# Altium schematic sheet FpgaCore.SchDoc: IrDA
size A4; Organization: Microprocessor-Design Pty Ltd; Address1: 18/110 Caroline Street; Address2: South Yarra; Address3: VIC 3141; Address4: Australia; DocumentNumber: 1; SheetNumber: 1; SheetTotal: 3
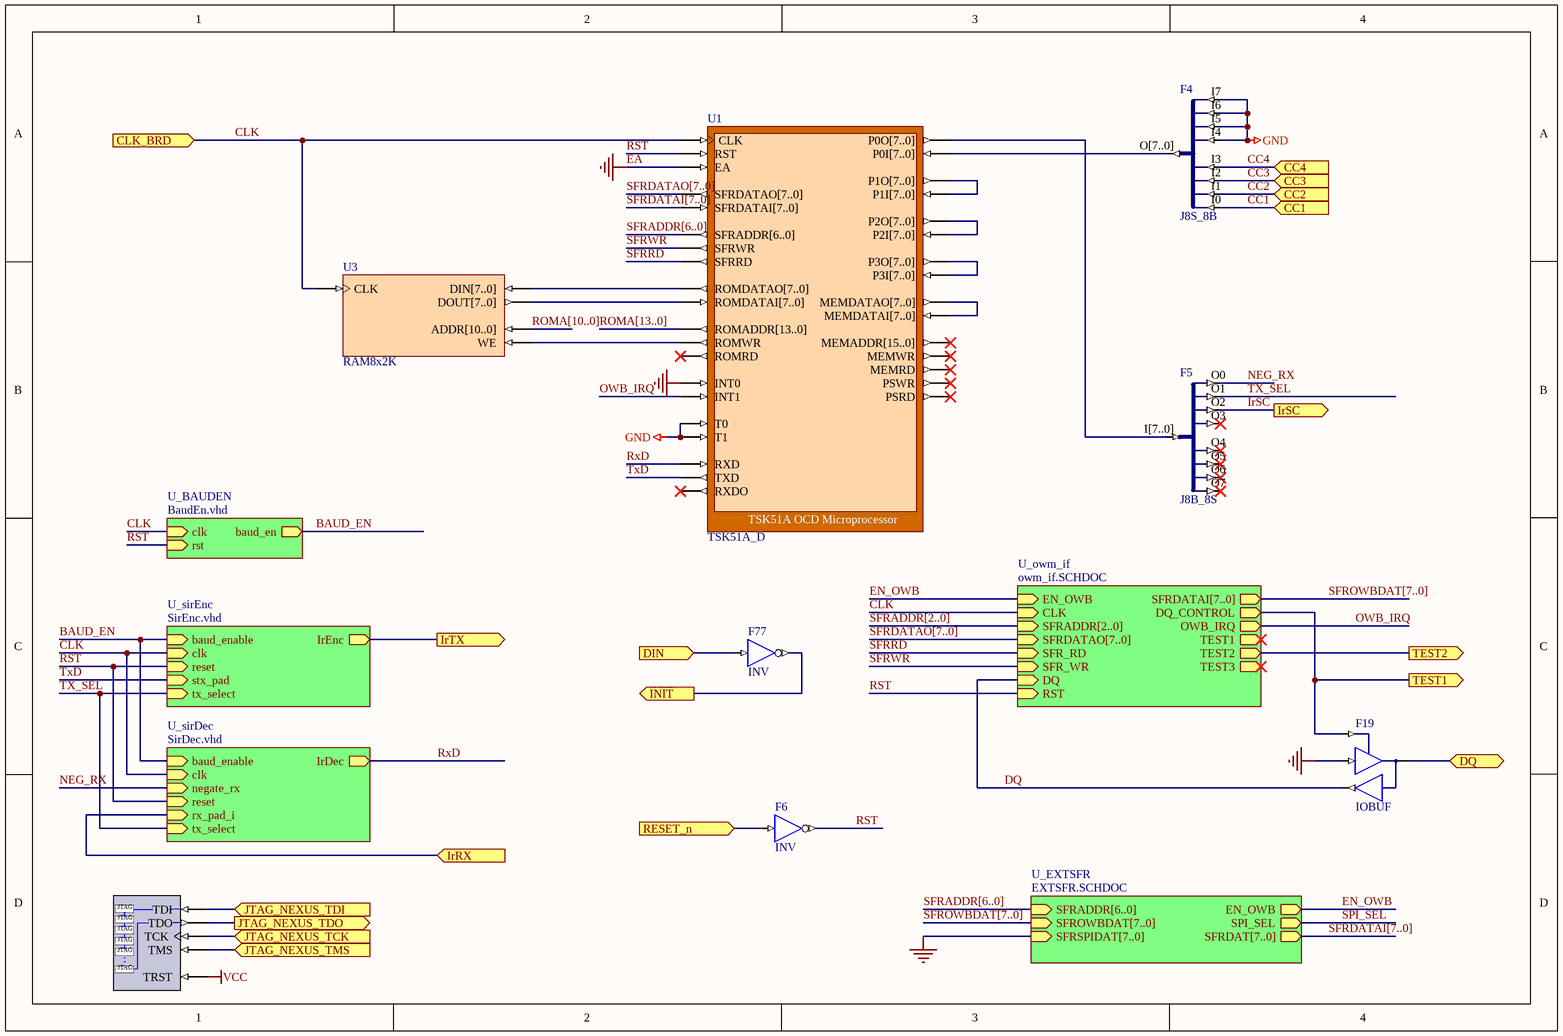
[diagram p0: FpgaCore.SchDoc]

## Parts
F4  J8S_8B
F5  J8B_8S
F6  INV
F19  IOBUF
F77  INV
NEXUS_JTAG_PORT  NEXUS_JTAG_PORT  (value not drawn)
U1  TSK51A_D
U3  RAM8x2K

## Sub-sheets
U_BAUDEN = BaudEn.vhd: baud_en (out), clk (in), rst (in)  | VHDLENTITY: BAUDEN
U_EXTSFR = EXTSFR.SCHDOC: SFRADDR[6..0] (in), EN_OWB (out), SPI_SEL (out), SFROWBDAT[7..0] (in), SFRSPIDAT[7..0] (in), SFRDAT[7..0] (out)
U_owm_if = owm_if.SCHDOC: EN_OWB (in), CLK (in), SFRADDR[2..0] (in), SFRDATAO[7..0] (in), SFRDATAI[7..0] (out), DQ_CONTROL (out), OWB_IRQ (out), SFR_RD (in), SFR_WR (in), DQ (in), RST (in), TEST1 (out), TEST2 (out), TEST3 (out)
U_sirDec = SirDec.vhd: baud_enable (in), clk (in), IrDec (out), negate_rx (in), reset (in), rx_pad_i (in), tx_select (in)  | VHDLENTITY: sirDec
U_sirEnc = SirEnc.vhd: baud_enable (in), clk (in), IrEnc (out), reset (in), stx_pad (in), tx_select (in)  | VHDLENTITY: sirEnc

## Ports
CC1 (in), CC2 (in), CC3 (in), CC4 (in), CLK_BRD (in), DIN (in), DQ (bidir), INIT (out), IrRX (in), IrSC (out), IrTX (out), JTAG_NEXUS_TCK (in), JTAG_NEXUS_TDI (in), JTAG_NEXUS_TDO (out), JTAG_NEXUS_TMS (in), RESET_n (in), TEST1 (out), TEST2 (out)

## Nets
EA: F4.I4 F4.I5 F4.I6 F4.I7 F19.I U1.EA U1.INT0 U1.T0 U1.T1  [also labelled GND]
VCC: NEXUS_JTAG_PORT.TRST
BAUD_EN: sheet U_sirDec/baud_enable, sheet U_sirEnc/baud_enable, sheet U_BAUDEN/baud_en
CC1: F4.I0 ; port CC1
CC2: F4.I1 ; port CC2
CC3: F4.I2 ; port CC3
CC4: F4.I3 ; port CC4
CLK: U1.CLK U3.CLK ; port CLK_BRD, sheet U_sirDec/clk, sheet U_sirEnc/clk, sheet U_BAUDEN/clk, sheet U_owm_if/CLK
DIN: F77.I ; port DIN
DQ: F19.O ; sheet U_owm_if/DQ
DQ: F19.IO ; port DQ  [a separate net that carries the same name]
EN_OWB: sheet U_EXTSFR/EN_OWB, sheet U_owm_if/EN_OWB
INIT: F77.O ; port INIT
IrRX: port IrRX, sheet U_sirDec/rx_pad_i
IrSC: F5.O2 ; port IrSC
IrTX: port IrTX, sheet U_sirEnc/IrEnc
JTAG_NEXUS_TCK: NEXUS_JTAG_PORT.TCK ; port JTAG_NEXUS_TCK
JTAG_NEXUS_TDI: NEXUS_JTAG_PORT.TDI ; port JTAG_NEXUS_TDI
JTAG_NEXUS_TDO: NEXUS_JTAG_PORT.TDO ; port JTAG_NEXUS_TDO
JTAG_NEXUS_TMS: NEXUS_JTAG_PORT.TMS ; port JTAG_NEXUS_TMS
NEG_RX: F5.O0 ; sheet U_sirDec/negate_rx
OWB_IRQ: U1.INT1 ; sheet U_owm_if/OWB_IRQ
RESET_n: F6.I ; port RESET_n
ROMA[10..0]: U3.ADDR[10..0]
ROMA[13..0]: U1.ROMADDR[13..0]
RST: F6.O U1.RST ; sheet U_sirDec/reset, sheet U_sirEnc/reset, sheet U_BAUDEN/rst, sheet U_owm_if/RST
RxD: U1.RXD ; sheet U_sirDec/IrDec
SFRADDR[6..0]: U1.SFRADDR[6..0] ; sheet U_EXTSFR/SFRADDR[6..0]
SFRDATAI[7..0]: U1.SFRDATAI[7..0] ; sheet U_EXTSFR/SFRDAT[7..0]
SFRDATAO[7..0]: U1.SFRDATAO[7..0] ; sheet U_owm_if/SFRDATAO[7..0]
SFRRD: U1.SFRRD ; sheet U_owm_if/SFR_RD
SFRWR: U1.SFRWR ; sheet U_owm_if/SFR_WR
SPI_SEL: sheet U_EXTSFR/SPI_SEL
TEST1: F19.T ; port TEST1, sheet U_owm_if/DQ_CONTROL
TEST2: port TEST2, sheet U_owm_if/TEST2
TX_SEL: F5.O1 ; sheet U_sirDec/tx_select, sheet U_sirEnc/tx_select
TxD: U1.TXD ; sheet U_sirEnc/stx_pad
NetF4_O[7..0]: F4.O[7..0] U1.P0I[7..0]
NetF5_I[7..0]: F5.I[7..0] U1.P0O[7..0]
NetU1_MEMDATAI[7..0]: U1.MEMDATAI[7..0] U1.MEMDATAO[7..0]
NetU1_P1I[7..0]: U1.P1I[7..0] U1.P1O[7..0]
NetU1_P2I[7..0]: U1.P2I[7..0] U1.P2O[7..0]
NetU1_P3I[7..0]: U1.P3I[7..0] U1.P3O[7..0]
NetU1_ROMDATAI[7..0]: U1.ROMDATAI[7..0] U3.DOUT[7..0]
NetU1_ROMDATAO[7..0]: U1.ROMDATAO[7..0] U3.DIN[7..0]
NetU1_ROMWR: U1.ROMWR U3.WE

Not connected (* = marked no-connect by the designer): F5 O3* O4* O5* O6* O7*; U1 MEMADDR[15..0]* MEMRD* MEMWR* PSRD* PSWR* ROMRD* RXDO*

## Buses and harness runs
bus ROMA[10..0]
bus ROMA[13..0]
bus SFRADDR[2..0] = sheet U_owm_if/SFRADDR[2..0]
bus SFRADDR[6..0]
bus SFRADDR[6..0] = sheet U_EXTSFR/SFRADDR[6..0]
bus SFRDATAI[7..0]
bus SFRDATAI[7..0] = sheet U_EXTSFR/SFRDAT[7..0]
bus SFRDATAO[7..0]
bus SFRDATAO[7..0] = sheet U_owm_if/SFRDATAO[7..0]
bus SFROWBDAT[7..0] = sheet U_EXTSFR/SFROWBDAT[7..0]
bus SFROWBDAT[7..0] = sheet U_owm_if/SFRDATAI[7..0]

## Notes on the sheet
- Labels drawn without touching a wire or pin: GNDBUS[..]
- Title
- Size:
- Date:
- A4
- Number:
- Time:
- Revision:
- Sheet
- of
- File:
- (in symbol NEXUS_JTAG_PORT) JTAG; .

## Library data of the parts
F4 = J8S_8B: 8 Single pin inputs to single 8-Bit output bus; ArchiveName: GENERIC; Published: 9-30-2003; Publisher: Altium Limited; Core Revision: 1.00.00
F5 = J8B_8S: 8-Bit input bus to 8 single pin outputs; ArchiveName: GENERIC; Published: 9-30-2003; Publisher: Altium Limited; Core Revision: 1.00.00
F6 F77 = INV: Inverter; ArchiveName: GENERIC; Published: 7-Nov-2003; Publisher: Altium Limited; Xilinx Equivalent: INV; Core Revision: 1.00.00
F19 = IOBUF: Input/Output Buffer; ArchiveName: GENERIC; Published: 18-Nov-2003; Publisher: Altium Limited; Xilinx Equivalent: IOBUF; Core Revision: 1.00.00
NEXUS_JTAG_PORT = NEXUS_JTAG_PORT: Nexus Processor JTAG Chain Connector; NEXUS_JTAG_CONNECTOR: True; Published: 18-Nov-2003; Publisher: Altium Limited
U1 = TSK51A_D: TSK51A OCD Microprocessor; NEXUS_CORE: Processor_OCDS; NEXUS_JTAG_DEVICE: True; NEXUS_JTAG_ORDER: 0; ChildModel1: RAM256x8_TSK51D; ChildCore1: U3; Memory_Configuration: Record[NEXUS_CORE]{}ComponentDesignator[iram]{}Memory_Depth[256]{}Memory_UsageType[ram]{}ProgramDownloadAddress[0x0]{}Memory_BusType[c51:idata_bus]{n}Record[NEXUS_CORE]{}ComponentDesignator[xram]{}Memory_Depth[64k]{}Memory_UsageType[ram]{}ProgramDownloadAddress[0x0]{}Memory_BusType[c51:xdata_bus]{n}Record[NEXUS_CORE]{}ComponentDesignator[xrom]{}Memory_Depth[64k]{}Memory_UsageType[rom]{}ProgramDownloadAddress[0x0]{}Memory_BusType[c51:code_bus]{n}; Published: 23/10/2003; Publisher: Altium Hobart Technology Centre; Core Revision: 1.00.00
U3 = RAM8x2K: Single Port Random Access Memory 2048 x 8; Memory_Depth: 2048; Memory_Type: RAM_SinglePortBlock; Memory_Width: 8; Memory_ClockEdge: Rising; Nexus_Core: Memory_Program; Published: 26/09/2003; Publisher: Altium Hobart Technology Center